# EAGLE board control_unit (EAGLE 5.11)
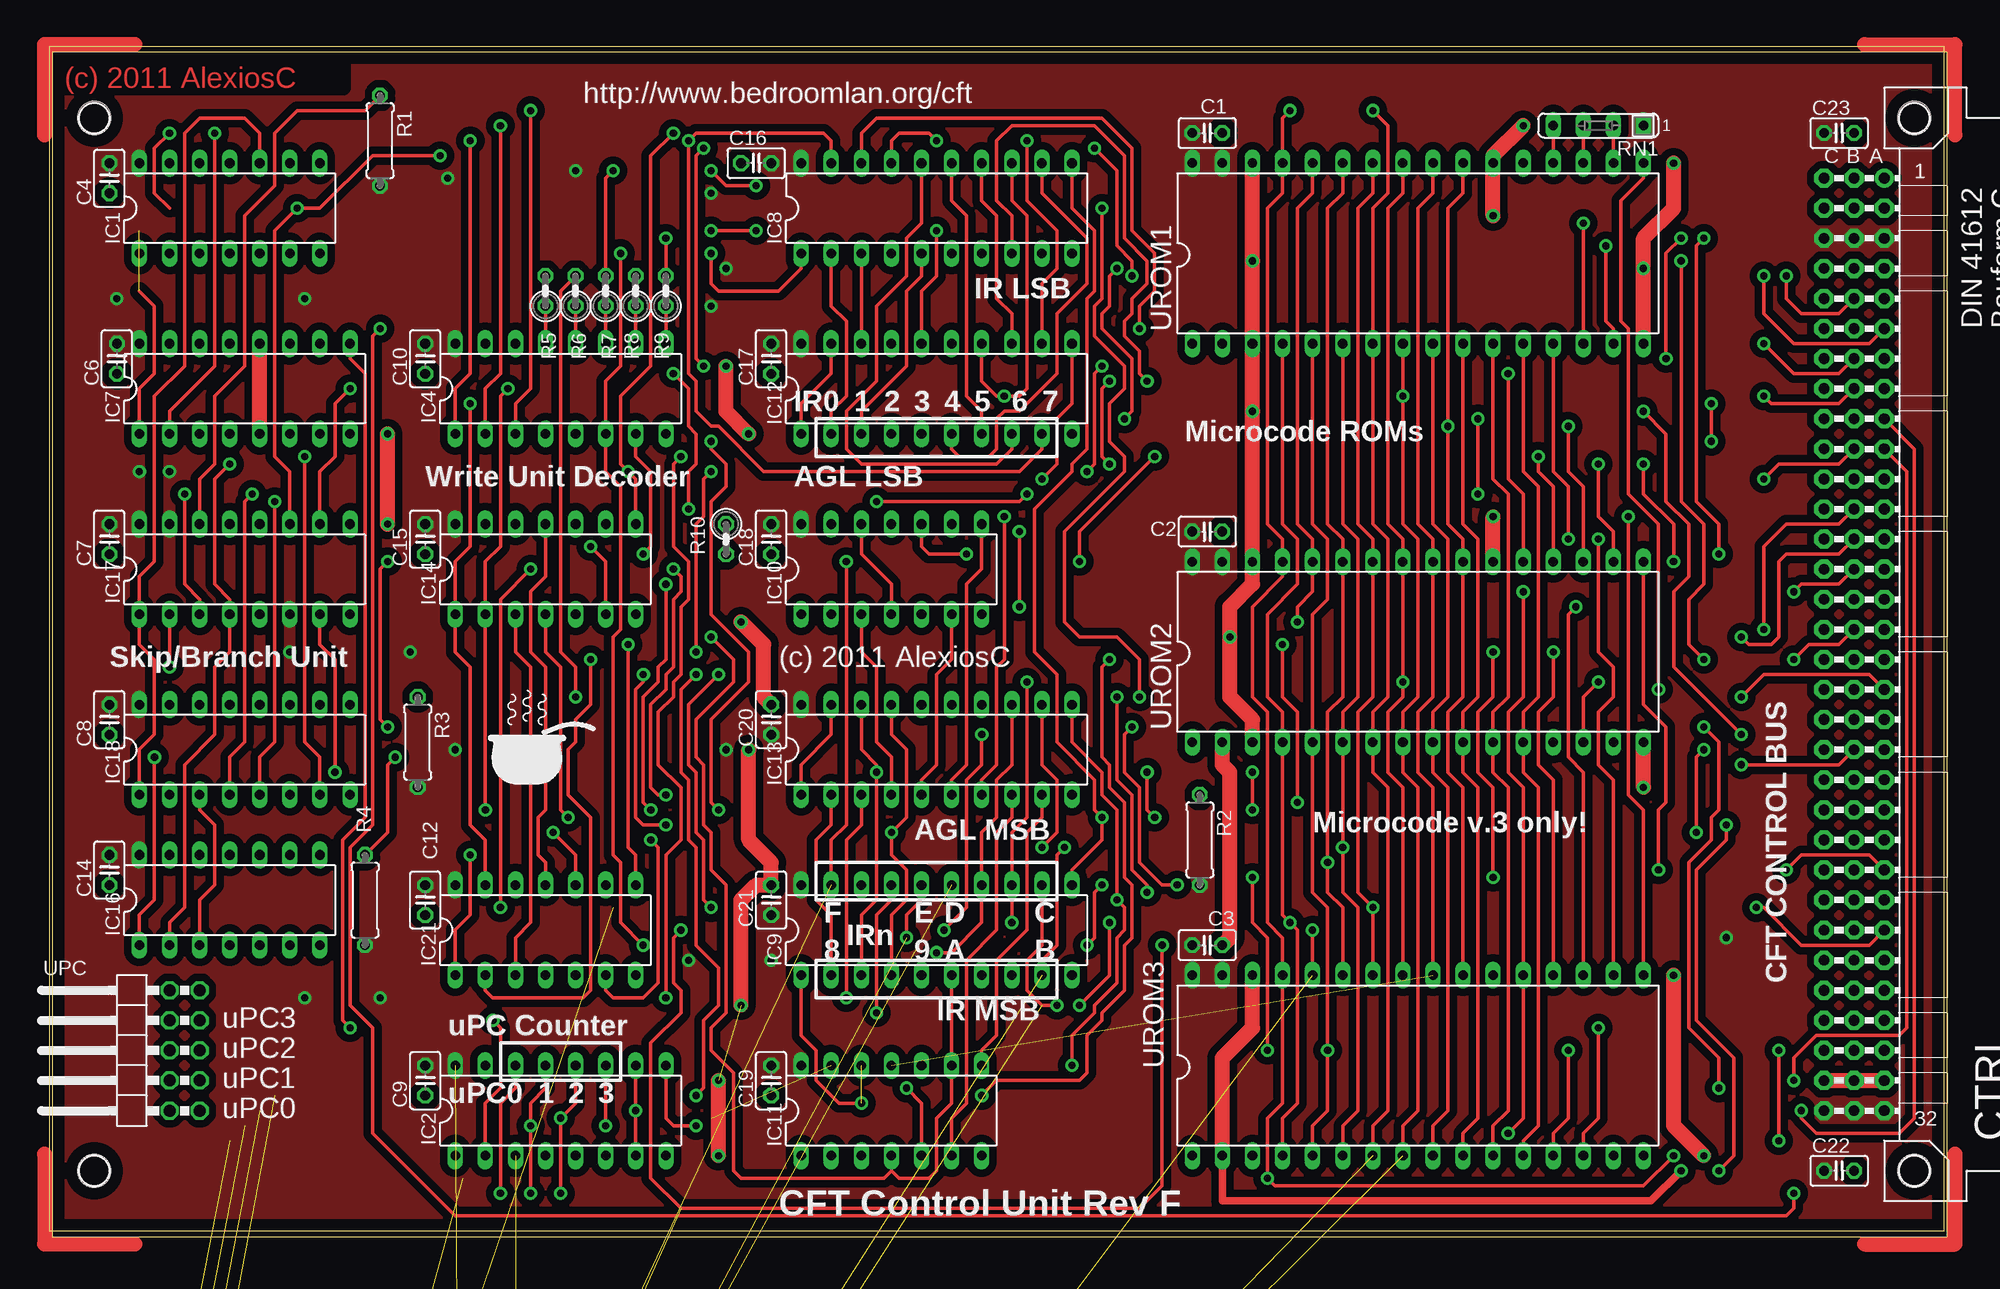
[diagram p4: board, top side]
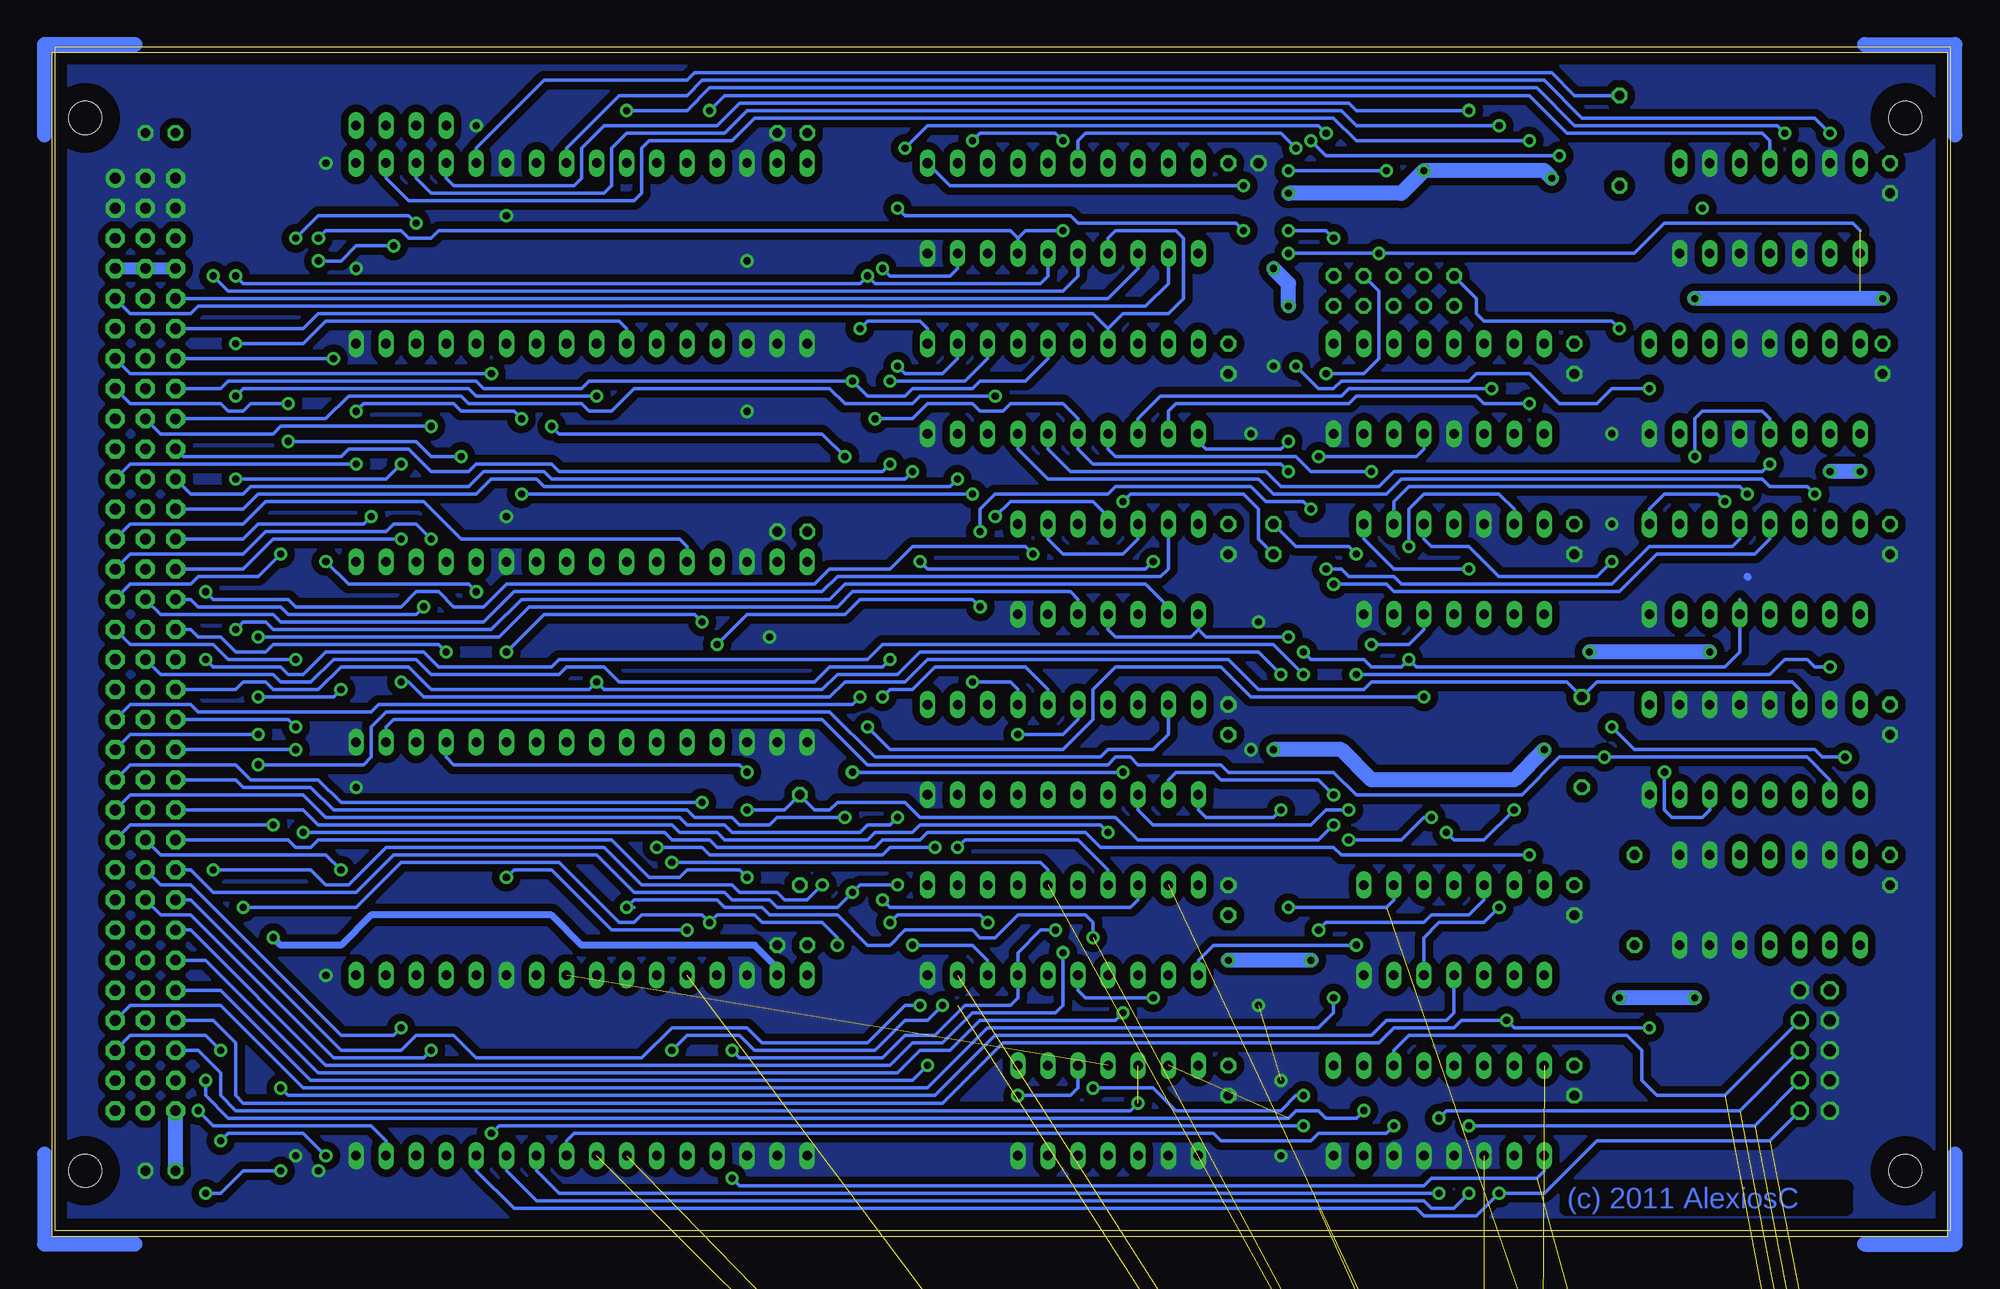
[diagram p5: board, bottom side, seen from below]

Size 160 x 100 mm. Coordinates in mm from the lower left corner, seen from the top.
Outline: 0,0 160,0 160,100 0,100 0,0
Copper layers (1*16): off 0.035mm / dielectric 1.5mm / Bottom 0.035mm
Design rules "cft-olimex-10mil": minimum track width 10mil, minimum drill 24mil, track to track 10mil, track to pad 10mil, pad to pad 10mil, via to via 10mil, smd to smd 10mil, copper to edge 40mil, drill to drill 10mil, minimum pad ring 10mil, minimum via ring 10mil, stop-mask expansion 0mil, vias tented up to drill 10mil, thermal gap 10mil
Net classes: 0 default: width 0.305 mm, clearance 0.254 mm; 1 Power: width 0.635 mm, clearance 0.254 mm; 2 12V: width 0.635 mm, clearance 0.635 mm

## Footprints (pad centres in the part's own frame; a part is rotated, then mirrored left to right if it is on the bottom)
C025-025X050 = drill 0.813 octagon: 1 -1.27,0; 2 1.27,0
VG96B = drill 0.914 pad 1.6 round: A1 154.94,39.37 | drill 0.914 pad 1.6 octagon: A2 154.94,36.83; A3 154.94,34.29; A4 154.94,31.75; A5 154.94,29.21; A6 154.94,26.67; A7 154.94,24.13; A8 154.94,21.59; A9 154.94,19.05; A10 154.94,16.51; A11 154.94,13.97; A12 154.94,11.43; A13 154.94,8.89; A14 154.94,6.35; A15 154.94,3.81; A16 154.94,1.27; A17 154.94,-1.27; A18 154.94,-3.81; A19 154.94,-6.35; A20 154.94,-8.89; A21 154.94,-11.43; A22 154.94,-13.97; A23 154.94,-16.51; A24 154.94,-19.05; A25 154.94,-21.59; A26 154.94,-24.13; A27 154.94,-26.67; A28 154.94,-29.21; A29 154.94,-31.75; A30 154.94,-34.29; A31 154.94,-36.83; A32 154.94,-39.37; B1 152.4,39.37; B2 152.4,36.83; B3 152.4,34.29; B4 152.4,31.75; B5 152.4,29.21; B6 152.4,26.67; B7 152.4,24.13; B8 152.4,21.59; B9 152.4,19.05; B10 152.4,16.51; B11 152.4,13.97; B12 152.4,11.43; B13 152.4,8.89; B14 152.4,6.35; B15 152.4,3.81; B16 152.4,1.27; B17 152.4,-1.27; B18 152.4,-3.81; B19 152.4,-6.35; B20 152.4,-8.89; B21 152.4,-11.43; B22 152.4,-13.97; B23 152.4,-16.51; B24 152.4,-19.05; B25 152.4,-21.59; B26 152.4,-24.13; B27 152.4,-26.67; B28 152.4,-29.21; B29 152.4,-31.75; B30 152.4,-34.29; B31 152.4,-36.83; B32 152.4,-39.37; C1 149.86,39.37; C2 149.86,36.83; C3 149.86,34.29; C4 149.86,31.75; C5 149.86,29.21; C6 149.86,26.67; C7 149.86,24.13; C8 149.86,21.59; C9 149.86,19.05; C10 149.86,16.51; C11 149.86,13.97; C12 149.86,11.43; C13 149.86,8.89; C14 149.86,6.35; C15 149.86,3.81; C16 149.86,1.27; C17 149.86,-1.27; C18 149.86,-3.81; C19 149.86,-6.35; C20 149.86,-8.89; C21 149.86,-11.43; C22 149.86,-13.97; C23 149.86,-16.51; C24 149.86,-19.05; C25 149.86,-21.59; C26 149.86,-24.13; C27 149.86,-26.67; C28 149.86,-29.21; C29 149.86,-31.75; C30 149.86,-34.29; C31 149.86,-36.83; C32 149.86,-39.37 | hole 2.794: 157.48,44.45; 157.48,-44.45; 3.81,44.45; 3.81,-44.45
DIL14 = drill 0.813 long: 1 -7.62,-3.81; 2 -5.08,-3.81; 3 -2.54,-3.81; 4 0,-3.81; 5 2.54,-3.81; 6 5.08,-3.81; 7 7.62,-3.81; 8 7.62,3.81; 9 5.08,3.81; 10 2.54,3.81; 11 0,3.81; 12 -2.54,3.81; 13 -5.08,3.81; 14 -7.62,3.81
DIL16 = drill 0.813 long: 1 -8.89,-3.81; 2 -6.35,-3.81; 3 -3.81,-3.81; 4 -1.27,-3.81; 5 1.27,-3.81; 6 3.81,-3.81; 7 6.35,-3.81; 8 8.89,-3.81; 9 8.89,3.81; 10 6.35,3.81; 11 3.81,3.81; 12 1.27,3.81; 13 -1.27,3.81; 14 -3.81,3.81; 15 -6.35,3.81; 16 -8.89,3.81
SO20W = smd 0.66 x 2.032: 1 -5.715,-5.029; 2 -4.445,-5.029; 3 -3.175,-5.029; 4 -1.905,-5.029; 5 -0.635,-5.029; 6 0.635,-5.029; 7 1.905,-5.029; 8 3.175,-5.029; 9 4.445,-5.029; 10 5.715,-5.029; 11 5.715,5.029; 12 4.445,5.029; 13 3.175,5.029; 14 1.905,5.029; 15 0.635,5.029; 16 -0.635,5.029; 17 -1.905,5.029; 18 -3.175,5.029; 19 -4.445,5.029; 20 -5.715,5.029
DIL20 = drill 0.813 long: 1 -11.43,-3.81; 2 -8.89,-3.81; 3 -6.35,-3.81; 4 -3.81,-3.81; 5 -1.27,-3.81; 6 1.27,-3.81; 7 3.81,-3.81; 8 6.35,-3.81; 9 8.89,-3.81; 10 11.43,-3.81; 11 11.43,3.81; 12 8.89,3.81; 13 6.35,3.81; 14 3.81,3.81; 15 1.27,3.81; 16 -1.27,3.81; 17 -3.81,3.81; 18 -6.35,3.81; 19 -8.89,3.81; 20 -11.43,3.81
0207/7 = drill 0.813 octagon: 1 -3.81,0; 2 3.81,0
0207/2V = drill 0.813 octagon: 1 -1.27,0; 2 1.27,0
SIL4 = drill 0.813 long: 1 -3.81,0; 2 -1.27,0; 3 1.27,0; 4 3.81,0
2X05/90 = drill 1.016 octagon: 1 -5.08,-6.35; 2 -5.08,-3.81; 3 -2.54,-6.35; 4 -2.54,-3.81; 5 0,-6.35; 6 0,-3.81; 7 2.54,-6.35; 8 2.54,-3.81; 9 5.08,-6.35; 10 5.08,-3.81
DIL32 = drill 0.813 long: 1 -19.05,-7.62; 2 -16.51,-7.62; 3 -13.97,-7.62; 4 -11.43,-7.62; 5 -8.89,-7.62; 6 -6.35,-7.62; 7 -3.81,-7.62; 8 -1.27,-7.62; 9 1.27,-7.62; 10 3.81,-7.62; 11 6.35,-7.62; 12 8.89,-7.62; 13 11.43,-7.62; 14 13.97,-7.62; 15 16.51,-7.62; 16 19.05,-7.62 | drill 0.8 long: 17 19.05,7.62; 18 16.51,7.62; 19 13.97,7.62; 20 11.43,7.62; 21 8.89,7.62; 22 6.35,7.62; 23 3.81,7.62; 24 1.27,7.62; 25 -1.27,7.62; 26 -3.81,7.62; 27 -6.35,7.62; 28 -8.89,7.62; 29 -11.43,7.62; 30 -13.97,7.62; 31 -16.51,7.62; 32 -19.05,7.62
22-23-2081 = drill 1 long: 1 -8.89,0; 2 -6.35,0; 3 -3.81,0; 4 -1.27,0; 5 1.27,0; 6 3.81,0; 7 6.35,0; 8 8.89,0

## Placement (x,y rotation side)
C1  0.1uF  [C025-025X050]  97.79,92.71 180 top
C2  0.1uF  [C025-025X050]  97.79,59.05 180 top
C3  0.1uF  [C025-025X050]  97.79,24.13 180 top
C4  0.1uF  [C025-025X050]  5.08,88.9 90 top
C5  0.1uF  [C025-025X050]  12.7,-93.98 0 top  (outside the outline)
C6  0.1uF  [C025-025X050]  5.71,73.66 90 top
C7  0.1uF  [C025-025X050]  5.08,58.42 90 top
C8  0.1uF  [C025-025X050]  5.08,43.18 90 top
C9  0.1uF  [C025-025X050]  31.75,12.7 90 top
C10  0.1uF  [C025-025X050]  31.75,73.66 90 top
C11  0.1uF  [C025-025X050]  19.68,-93.98 0 top  (outside the outline)
C12  0.1uF  [C025-025X050]  31.75,27.94 90 top
C13  0.1uF  [C025-025X050]  26.67,-93.98 0 top  (outside the outline)
C14  0.1uF  [C025-025X050]  5.08,30.48 90 top
C15  0.1uF  [C025-025X050]  31.75,58.42 90 top
C16  0.1uF  [C025-025X050]  59.69,90.17 0 top
C17  0.1uF  [C025-025X050]  60.96,73.66 90 top
C18  0.1uF  [C025-025X050]  60.96,58.42 90 top
C19  0.1uF  [C025-025X050]  60.96,12.7 90 top
C20  0.1uF  [C025-025X050]  60.96,43.18 90 top
C21  0.1uF  [C025-025X050]  60.96,27.94 90 top
C22  0.1uF  [C025-025X050]  151.13,5.08 0 top
C23  0.1uF  [C025-025X050]  151.13,92.71 0 top
C24  0.1uF  [C025-025X050]  33.66,-93.98 0 top  (outside the outline)
C25  0.1uF  [C025-025X050]  40.64,-93.98 0 top  (outside the outline)
C26  0.1uF  [C025-025X050]  47.62,-93.98 0 top  (outside the outline)
CTRL  [VG96B]  0,49.53 0 top
IC1  74HCT04N  [DIL14]  15.24,86.36 0 top
IC2  74ACT161N?  [DIL16]  43.18,10.16 0 top
IC3  74HC541DW  [SO20W]  -3.17,-104.78 0 top  (outside the outline)
IC4  74HCT138N  [DIL16]  43.18,71.12 0 top
IC5  74HC541DW  [SO20W]  -3.17,-117.47 0 top  (outside the outline)
IC7  74ACT175N  [DIL16]  16.51,71.12 0 top
IC8  74ACT273N  [DIL20]  74.93,86.36 0 top
IC9  74ACT273N  [DIL20]  74.93,25.4 0 top
IC10  74ACT08N  [DIL14]  71.12,55.88 0 top
IC11  74ACT08N  [DIL14]  71.12,10.16 0 top
IC12  74HCT541N  [DIL20]  74.93,71.12 0 top
IC13  74HCT541N  [DIL20]  74.93,40.64 0 top
IC14  74HCT4075E  [DIL14]  41.91,55.88 0 top
IC16  74HCT266N  [DIL14]  15.24,27.94 0 top
IC17  74ACT253N  [DIL16]  16.51,55.88 0 top
IC18  74ACT253N  [DIL16]  16.51,40.64 0 top
IC21  74ACT08N  [DIL14]  41.91,25.4 0 top
R1  2k2  [0207/7]  27.94,92.08 270 top
R2  2k2  [0207/7]  97.16,33.02 270 top
R3  2k2  [0207/7]  31.11,41.27 270 top
R4  2k2  [0207/7]  26.67,27.94 270 top
R5  47R  [0207/2V]  41.91,79.38 90 top
R6  47R  [0207/2V]  44.45,79.38 90 top
R7  47R  [0207/2V]  46.99,79.38 90 top
R8  47R  [0207/2V]  49.53,79.38 90 top
R9  47R  [0207/2V]  52.07,79.38 90 top
R10  47R  [0207/2V]  57.15,58.42 270 top
RN1  2k2  [SIL4]  130.81,93.34 180 top
U$3  SIGNATURESILK  [SIGNATURE]  37.47,37.47 0 top
UPC  [2X05/90]  6.35,15.24 90 top
UROM1  29F040  [DIL32]  115.57,82.55 0 top
UROM2  29F040  [DIL32]  115.57,48.9 0 top
UROM3  29F040  [DIL32]  115.57,13.97 0 top
X1  22-23-2081  [22-23-2081]  -1.27,-129.54 0 top  (outside the outline)
X2  22-23-2081  [22-23-2081]  -1.91,-140.97 0 top  (outside the outline)

## Tracks (layer width: path | path; a pad name or v marks a point on that pad's centre or on a via)
!CLI  (via drill 0.6)
  off 0.305: v123.19,72.39 123.19,63.5 124.46,62.23 UROM2.21
  Bottom 0.305: v123.19,72.39 153.67,72.39 CTRL.A7
!CLL  (via drill 0.6)
  off 0.305: v128.27,67.94 128.27,64.14 129.54,62.87 UROM2.19
  Bottom 0.305: CTRL.B9 151.13,67.31 141.6,67.31 140.97,67.94 v128.27,67.94
!CPL  (via drill 0.6)
  off 0.305: v130.81,64.77 130.81,60.33 132.08,59.05 UROM2.18 | CTRL.B10 151.13,64.77 146.05,64.77 v144.78,63.5
  Bottom 0.305: v144.78,63.5 132.08,63.5 v130.81,64.77
!END  (via drill 0.6)
  off 0.305: v124.46,53.98 124.46,45.09 123.19,43.81 123.19,38.73 124.46,37.47 UROM3.21 124.46,9.53 v123.19,8.26 | v137.16,56.52 137.16,59.69 134.62,62.23 v134.62,64.77 | IC2.9 52.07,9.53 52.7,8.89 v54.61,8.89
  Bottom 0.305: v124.46,53.98 125.09,54.61 135.25,54.61 v137.16,56.52 | v134.62,64.77 153.67,64.77 CTRL.A11 | v54.61,8.89 122.56,8.89 v123.19,8.26
!HALT  (via drill 0.6)  (1 unrouted)
  off 0.305: IC2.7 v49.53,10.16 IC2.10 | CTRL.A10 156.84,64.14 156.84,17.14 156.21,16.51 149.22,16.51 147.32,14.61 v147.32,12.7
  Bottom 0.305: v147.32,12.7 147.32,11.43 145.41,9.53 55.88,9.53 55.24,10.16 53.34,10.16 52.7,9.53 50.16,9.53 v49.53,10.16
!INCAC  (via drill 0.6)
  off 0.305: UROM2.17 134.62,44.45 136.53,42.55 136.53,36.2 135.89,35.56 v135.89,30.48
  Bottom 0.305: v135.89,30.48 137.16,31.75 151.13,31.75 CTRL.B23
!INCDR  (via drill 0.6)
  off 0.305: v130.81,17.14 130.81,9.53 129.54,8.26 UROM3.14
  Bottom 0.305: v130.81,17.14 131.44,16.51 135.89,16.51 148.59,29.21 151.13,29.21 CTRL.B24
!INCPC  (via drill 0.6)
  off 0.305: UROM3.13 127,8.26 128.27,9.53 v128.27,15.24
  Bottom 0.305: v128.27,15.24 128.91,14.61 136.53,14.61 148.59,26.67 151.13,26.67 CTRL.B25
!IO  (via drill 0.6)
  off 0.305: UROM3.18 132.08,38.1 130.81,39.37 130.81,43.81 132.08,45.09 132.08,47.62 130.81,48.9 v130.81,58.42
  Bottom 0.305: v130.81,58.42 141.6,58.42 144.15,55.88 CTRL.C14
!IRQS  (via drill 0.6)  (1 unrouted)
  off 0.305: UROM1.28 106.68,87.63 105.41,86.36 105.41,59.69 106.68,58.42 UROM2.28 106.68,53.98 105.41,52.7 v105.41,51.44 | v121.92,48.9 121.92,45.09 120.65,43.81 120.65,38.73 121.92,37.47 v121.92,29.84 | UROM3.28 v106.68,25.4
  Bottom 0.305: CTRL.A13 153.67,59.69 144.15,59.69 142.24,61.59 128.91,61.59 125.73,58.42 107.31,58.42 106.68,57.78 UROM2.28 | v105.41,51.44 106.05,52.07 118.75,52.07 v121.92,48.9 | v106.68,25.4 113.03,25.4 118.11,30.48 121.28,30.48 v121.92,29.84
!MEM  (via drill 0.6)
  off 0.305: UROM3.17 134.62,35.56 133.35,36.83 v133.35,60.33
  Bottom 0.305: v133.35,60.33 133.99,59.69 142.88,59.69 144.15,58.42 CTRL.C13
!R  (via drill 0.6)
  off 0.305: UROM3.19 129.54,38.73 128.27,40.01 128.27,52.07 v128.91,52.7
  Bottom 0.305: v128.91,52.7 129.54,52.07 140.34,52.07 140.97,52.7 147.96,52.7 148.59,53.34 CTRL.C15
!RAGL  (via drill 0.6)
  off 0.305: CTRL.B20 151.13,39.37 v142.88,39.37 | IC13.1 63.5,39.37 66.04,41.91 IC13.19 | v56.52,35.56 55.88,36.2 55.88,43.18 59.05,46.35 59.05,48.9 55.88,52.07 55.88,61.59 57.15,62.87 57.15,64.77 55.88,66.04 v55.88,66.67 | IC12.1 63.5,69.85 66.04,72.39 IC12.19
  Bottom 0.305: v142.88,39.37 133.99,39.37 133.35,40.01 133.35,42.55 132.08,43.81 94.61,43.81 90.81,40.01 71.75,40.01 71.12,40.64 67.31,40.64 66.04,41.91 IC13.19 | IC13.1 63.5,35.56 62.87,34.92 57.15,34.92 v56.52,35.56 | IC12.1 63.5,66.67 62.87,66.04 56.52,66.04 v55.88,66.67
!RESET  (via drill 0.6)  (2 unrouted)
  off 0.305: IC7.1 7.62,71.12 8.89,72.39 8.89,78.11 7.62,79.38 | v50.16,24.13 48.26,26.04 48.26,31.11 47.62,31.75 47.62,50.16 48.26,50.8 48.26,62.87 46.99,64.14 IC4.6 46.99,71.75 48.26,73.03 v48.26,82.55 | IC9.1 63.5,16.51 64.77,15.24 64.77,12.7 66.67,10.79 v68.58,10.79 | v55.88,82.55 55.88,80.01 56.52,79.38 61.59,79.38 63.5,81.28 IC8.1
  Bottom 0.305: CTRL.C30 147.96,15.24 146.05,13.34 146.05,11.43 144.78,10.16 69.22,10.16 v68.58,10.79 | 7.62,84.45 8.26,85.09 24.13,85.09 26.67,82.55 v48.26,82.55 v55.88,82.55 | v50.16,24.13 62.23,24.13 63.5,22.86 IC9.1
!RSTHOLD  (via drill 0.6)  (1 unrouted)
  off 0.305: v146.05,7.62 v146.05,15.24 | v137.16,6.35 134.62,3.81 103.5,3.81 v102.87,4.45 102.87,9.53 104.14,10.79 UROM3.29 104.14,24.77 102.87,26.04 102.87,43.81 101.6,45.09 101.6,52.7 104.14,55.24 UROM2.29 104.14,58.42 102.87,59.69 102.87,86.36 104.14,87.63 UROM1.29 104.14,93.98 v104.78,94.61
  Bottom 0.305: IC2.1 34.29,5.08 34.92,4.45 43.81,4.45 44.45,3.81 102.23,3.81 v102.87,4.45 | IC1.11 15.24,92.08 15.88,92.71 32.38,92.71 35.56,95.89 103.5,95.89 v104.78,94.61 | CTRL.A30 153.67,16.51 147.32,16.51 v146.05,15.24 | v137.16,6.35 139.06,8.26 145.41,8.26 v146.05,7.62
!SKIP  (via drill 0.6)  (1 unrouted)
  off 0.305: UROM3.7 111.76,8.89 113.03,10.16 113.03,37.47 111.76,38.73 UROM2.7 111.76,43.81 113.03,45.09 113.03,58.42 111.76,59.69 UROM1.7 111.76,86.36 113.03,87.63 113.03,93.34 v111.76,94.61 | v13.97,92.71 13.97,73.03 10.16,69.22 IC7.2 | CTRL.B7 151.13,72.39 147.32,72.39 v144.78,74.93
  Bottom 0.305: v111.76,94.61 106.68,94.61 104.78,96.52 34.92,96.52 31.75,93.34 14.61,93.34 v13.97,92.71 | v144.78,74.93 139.06,74.93 137.16,76.83 112.39,76.83 111.76,76.2 UROM1.7
!STI  (via drill 0.6)
  off 0.305: UROM2.20 127,62.87 125.73,64.14 v125.73,65.41 | v140.34,66.67 v140.34,69.85
  Bottom 0.305: CTRL.A8 153.67,69.85 146.05,69.85 145.41,69.22 144.15,69.22 143.51,69.85 v140.34,69.85 | v125.73,65.41 128.27,65.41 129.54,66.67 v140.34,66.67
!W  (via drill 0.6)
  off 0.305: UROM3.20 127,38.1 125.73,39.37 125.73,43.81 127,45.09 v127,48.9
  Bottom 0.305: v127,48.9 127.64,49.53 141.6,49.53 142.24,48.9 144.78,48.9 146.05,50.16 147.96,50.16 148.59,50.8 CTRL.C16
!WAC  (via drill 0.6)
  off 0.305: v92.08,45.09 92.08,48.26 90.17,50.16 87,50.16 85.72,51.44 85.72,59.05 90.81,64.14 90.81,65.41 89.53,66.67 89.53,69.85 90.81,71.12 90.81,73.03 88.27,75.56 88.27,78.11 88.9,78.74 v88.9,86.36 | R9.2 v52.07,83.82 | v55.88,84.45 v59.69,84.45
  Bottom 0.305: CTRL.A19 153.67,44.45 148.59,44.45 147.96,43.81 133.35,43.81 132.72,44.45 92.71,44.45 v92.08,45.09 | v52.07,83.82 52.7,84.45 v55.88,84.45 | v88.9,86.36 88.27,85.72 74.3,85.72 73.66,85.09 60.33,85.09 v59.69,84.45
!WALU  (via drill 0.6)
  off 0.305: v69.85,61.59 81.92,61.59 v82.55,62.23 | v120.65,62.23 v120.65,68.58 | v134.62,69.22 136.53,67.31 136.53,61.59 138.43,59.69 138.43,55.24 137.16,53.98 137.16,47.62 v142.88,41.91
  Bottom 0.305: CTRL.A20 153.67,41.91 v142.88,41.91 | v69.85,61.59 69.22,62.23 59.69,62.23 58.42,60.96 58.42,58.42 R10.2 | v82.55,62.23 v120.65,62.23 | v120.65,68.58 121.28,69.22 125.73,69.22 126.36,69.85 133.99,69.85 v134.62,69.22
!WAR  (via drill 0.6)
  off 0.305: v27.94,76.2 27.3,75.56 27.3,34.29 25.4,32.38 25.4,19.05 27.3,17.14 27.3,8.26 34.29,1.27 146.69,1.27 147.32,1.91 v147.32,3.17 | v140.97,5.08 142.24,6.35 142.24,14.61 139.06,17.78 139.06,30.48 141.6,33.02 v141.6,34.29
  Bottom 0.305: CTRL.A23 153.67,34.29 v141.6,34.29 | v27.94,76.2 28.57,76.83 39.37,76.83 40.01,77.47 40.01,78.74 R5.2 | v147.32,3.17 146.05,3.17 144.15,5.08 v140.97,5.08
!WDR  (via drill 0.6)
  off 0.305: v104.14,49.53 104.14,45.09 105.41,43.81 v105.41,36.2 | v81.92,59.05 v81.92,52.7 | v53.98,60.96 53.98,64.14 54.61,64.77 54.61,67.31 53.98,67.94 53.98,71.12 v52.7,72.39
  Bottom 0.305: CTRL.A21 153.67,39.37 144.78,39.37 143.51,38.1 137.79,38.1 135.89,36.2 v105.41,36.2 | v104.14,49.53 101.6,52.07 93.34,52.07 92.08,53.34 82.55,53.34 v81.92,52.7 | v81.92,59.05 81.92,60.96 80.64,62.23 71.12,62.23 70.48,62.87 59.05,62.87 57.78,61.59 54.61,61.59 v53.98,60.96 | v52.7,72.39 49.53,72.39 48.26,73.66 48.26,79.38 R8.2
!WIR  (via drill 0.6)
  off 0.305: IC9.11 86.36,30.48 88.9,33.02 v88.9,34.92 88.27,35.56 88.27,38.1 85.09,41.27 85.09,46.99 83.19,48.9 83.19,60.96 86.36,64.14 86.36,64.77 87.63,66.04 87.63,78.74 88.27,79.38 88.27,84.45 86.36,86.36 IC8.11 | v47.62,89.53 46.99,88.9 R7.2 | v55.88,89.53 57.15,88.27 v59.69,88.27
  Bottom 0.305: v88.9,34.92 89.53,34.29 91.44,34.29 92.08,33.66 102.87,33.66 103.5,34.29 106.68,34.29 107.31,34.92 137.16,34.92 139.06,36.83 153.67,36.83 CTRL.A22 | v55.88,89.53 v47.62,89.53 | v59.69,88.27 84.45,88.27 IC8.11
!WPC  (via drill 0.6)
  off 0.305: CTRL.A24 153.67,31.75 147.96,31.75 v146.69,30.48 | v44.45,45.09 44.45,47.62 43.18,48.9 43.18,79.38 R6.2 | v91.44,42.55 90.81,41.91 90.81,38.73 92.08,37.47 92.08,31.11 93.98,29.21 v95.25,29.21
  Bottom 0.305: v44.45,45.09 59.05,45.09 61.59,47.62 70.48,47.62 72.39,45.72 72.39,43.18 74.93,40.64 89.53,40.64 v91.44,42.55 | v95.25,29.21 96.52,27.94 98.42,27.94 99.06,28.57 102.23,28.57 102.87,29.21 110.49,29.21 113.67,32.38 132.08,32.38 135.25,29.21 137.16,29.21 138.43,30.48 v146.69,30.48
+12V
  off 1.27: CTRL.C31 CTRL.B31 CTRL.A31
AINDEX  (via drill 0.6)  (1 unrouted)
  off 0.305: UROM3.8 114.3,8.89 115.57,10.16 115.57,37.47 114.3,38.73 UROM2.8 114.3,43.81 115.57,45.09 115.57,58.42 114.3,59.69 v114.3,70.48 UROM1.8 | CTRL.B8 151.13,69.85 145.41,69.85 v144.78,70.48
  Bottom 0.305: v144.78,70.48 144.15,71.12 125.09,71.12 124.46,70.48 v114.3,70.48
CLK1  (via drill 0.6)
  off 0.305: v37.47,17.78 38.1,17.14 38.1,12.06 36.83,10.79 IC2.2 | IC7.9 25.4,73.66 26.67,72.39 26.67,34.92 24.77,33.02 24.77,17.78 v25.4,17.14
  Bottom 0.305: v25.4,17.14 36.83,17.14 v37.47,17.78 41.27,17.78 41.91,17.14 46.99,17.14 48.26,15.88 80.01,15.88 85.09,10.79 144.15,10.79 144.78,11.43 144.78,15.88 146.69,17.78 CTRL.C29
CLK5  (via drill 0.6)
  off 0.305: v53.34,65.41 52.7,64.77 52.7,57.78 53.98,56.52 53.98,53.34 53.34,52.7 53.34,46.99 52.7,46.35 52.7,45.09 51.44,43.81 51.44,39.37 53.34,37.47 53.34,33.02 52.07,31.75 v52.07,19.68
  Bottom 0.305: CTRL.A29 153.67,19.05 146.05,19.05 139.06,12.06 86.36,12.06 81.28,17.14 53.34,17.14 52.07,18.41 v52.07,19.68 | v53.34,65.41 45.09,65.41 44.45,66.04 IC4.5
FL  (via drill 0.6)  (1 unrouted)
  off 0.305: v56.52,46.99 53.98,44.45 53.98,39.37 54.61,38.73 54.61,33.66 55.24,33.02 55.24,27.94 v55.88,27.3 | UROM1.25 114.3,87.63 113.03,86.36 113.03,59.69 114.3,58.42 UROM2.25 v114.3,46.35 114.3,45.09 113.03,43.81 113.03,38.73 114.3,37.47 UROM3.25
  Bottom 0.305: v56.52,46.99 58.42,48.9 87,48.9 88.9,46.99 93.98,46.99 95.25,45.72 113.67,45.72 v114.3,46.35 114.94,45.72 128.27,45.72 130.18,47.62 135.89,47.62 137.79,45.72 141.6,45.72 142.24,46.35 144.15,46.35 144.78,45.72 CTRL.C18 | v55.88,27.3 47.62,27.3 46.99,27.94 IC21.9
FNEG  (via drill 0.6)
  off 0.305: IC21.1 34.29,25.4 35.56,26.67 v35.56,31.75 | v139.06,33.66 139.06,40.01 v139.7,40.64
  Bottom 0.305: v35.56,31.75 51.44,31.75 52.07,32.38 71.75,32.38 73.03,33.66 86.36,33.66 87,33.02 90.17,33.02 90.81,32.38 104.14,32.38 104.78,33.02 107.95,33.02 108.58,33.66 v139.06,33.66 | v139.7,40.64 CTRL.C20
FV  (via drill 0.6)  (1 unrouted)
  off 0.305: UROM1.4 104.14,59.69 105.41,58.42 105.41,54.61 102.87,52.07 102.87,45.09 104.14,43.81 UROM2.4 104.14,26.67 v104.78,26.04 105.41,25.4 105.41,10.79 104.14,9.53 UROM3.4 | CTRL.A26 153.67,24.13 147.96,24.13 144.78,27.3 v144.15,27.3 | v53.34,25.4 52.7,24.77 52.7,20.95 53.34,20.32 53.34,18.41 50.8,15.88 50.8,4.45 53.34,1.91 92.08,1.91 93.98,3.81 v93.98,24.13
  Bottom 0.305: v144.15,27.3 134.62,27.3 130.81,31.11 117.47,31.11 112.39,26.04 111.12,26.04 110.49,26.67 105.41,26.67 v104.78,26.04 104.14,26.67 100.97,26.67 100.33,26.04 95.25,26.04 93.98,24.77 v93.98,24.13 | IC21.12 39.37,27.94 40.64,26.67 43.81,26.67 44.45,26.04 52.7,26.04 v53.34,25.4
FZERO  (via drill 0.6)
  off 0.305: v140.97,12.06 140.97,14.61 138.43,17.14 138.43,31.11 140.34,33.02 140.34,34.92 140.97,35.56 140.97,41.27 v139.7,42.55
  Bottom 0.305: IC21.4 41.91,18.41 42.55,17.78 47.62,17.78 48.9,16.51 80.64,16.51 85.72,11.43 140.34,11.43 v140.97,12.06 | v139.7,42.55 140.34,43.18 CTRL.C19
GND  (via drill 0.6, 0.61)  (13 unrouted)
  off 0.635: v137.79,5.08 135.25,2.54 99.06,2.54 99.06,5.71
  off 1.27: UROM3.2 99.06,14.61 101.6,17.14 UROM3.30 | IC7.5 IC7.12 | v56.52,6.35 v56.52,12.7 | v58.42,19.05 58.42,27.94 59.69,29.21 C21.2 60.96,31.11 59.05,33.02 v59.05,40.64 | UROM1.16 134.62,83.82 137.16,86.36 v137.16,90.17 | v124.46,93.34 121.92,90.81 UROM1.22 v121.92,85.72 | v137.16,21.59 137.16,8.89 v139.7,6.35 | UROM1.30 v101.6,81.92 UROM1.3 v101.6,69.22 UROM2.30 101.6,54.61 99.69,52.7 v99.69,50.16 99.69,45.09 101.6,43.18 UROM2.3 | UROM2.22 v121.92,60.33 | C3.1 99.69,24.77 99.69,38.73 99.06,39.37 UROM2.2 | v134.62,37.47 UROM2.16 | v57.15,73.03 57.15,69.22 v59.05,67.31 | C20.2 60.33,45.09 60.33,49.53 v58.42,51.44 | v28.57,59.69 v28.57,67.31
  Bottom 0.635: 17.12,55.22 17.14,55.24
  other vias: 134.62,81.28
  pour Bottom (isolate 0.635, no thermals): 0,0 160.02,0 160.02,99.06 0,99.06
IBUS0
  off 0.305: IC12.18 IC8.3
  Bottom 0.305: IC8.3 68.58,81.28 71.12,78.74 CTRL.C5
IBUS1
  Bottom 0.305: CTRL.C6 139.06,76.2 137.79,77.47 72.39,77.47 71.12,76.2 | IC8.4 71.12,83.82 70.48,84.45 65.41,84.45 64.77,83.82 64.77,78.74 66.04,77.47 69.85,77.47 71.12,76.2 | 71.12,76.2 IC12.17
IBUS2  (via drill 0.6)
  off 0.305: v137.79,83.82 136.53,82.55 v136.53,73.66 | IC12.16 73.66,79.38 74.93,80.64 v74.93,84.45
  Bottom 0.305: v137.79,83.82 137.16,84.45 130.81,84.45 130.18,83.82 128.27,83.82 127.64,84.45 79.38,84.45 78.74,83.82 | 78.74,83.82 IC8.7 | v136.53,73.66 CTRL.C7 | v74.93,84.45 78.11,84.45 78.74,83.82
IBUS3  (via drill 0.6)
  off 0.305: IC8.8 81.28,85.72 80.01,87 80.01,92.08 81.28,93.34 88.27,93.34 90.81,90.81 90.81,83.82 92.71,81.92 92.71,80.01 91.44,78.74 91.44,77.47 90.81,76.83 90.81,75.56 92.08,74.3 92.08,72.39 v92.71,71.75
  Bottom 0.305: CTRL.C8 146.05,71.12 145.41,71.75 124.46,71.75 123.83,71.12 115.57,71.12 114.94,71.75 v92.71,71.75 91.44,70.48 88.27,70.48 87.63,71.12 82.55,71.12 81.92,71.75 78.11,71.75 76.2,73.66 IC12.15
IBUS4  (via drill 0.6)
  off 0.305: IC8.13 81.28,87 82.55,85.72 82.55,71.12 81.92,70.48 v80.64,70.48 80.01,70.48 78.74,71.75 IC12.14
  Bottom 0.305: CTRL.C9 137.16,68.58 135.25,70.48 125.73,70.48 125.09,69.85 115.57,69.85 114.94,69.22 113.03,69.22 111.12,71.12 94.61,71.12 93.34,69.85 87.63,69.85 87,70.48 v80.64,70.48
IBUS5  (via drill 0.6)
  off 0.305: v89.53,64.77 88.9,65.41 88.9,71.12 v89.53,71.75 | IC8.14 78.74,87 80.01,85.72 80.01,78.74 81.28,77.47 IC12.13
  Bottom 0.305: CTRL.C10 149.22,65.41 135.89,65.41 135.25,66.04 130.18,66.04 128.27,64.14 125.09,64.14 124.46,64.77 118.11,64.77 117.47,64.14 90.17,64.14 v89.53,64.77 | v89.53,71.75 83.19,71.75 81.28,73.66 IC12.13
IBUS6  (via drill 0.6)
  off 0.305: v87.63,64.14 88.27,64.77 88.27,72.39 v88.9,73.03 | IC12.12 83.82,80.01 85.09,81.28 85.09,84.45 82.55,87 v82.55,92.08 | IC8.17 71.12,92.08 71.75,92.71 74.3,92.71 v74.93,92.08
  Bottom 0.305: v88.9,73.03 88.27,72.39 85.09,72.39 83.82,73.66 IC12.12 | v87.63,64.14 88.27,63.5 118.11,63.5 118.75,64.14 123.83,64.14 125.09,62.87 143.51,62.87 144.15,62.23 148.59,62.23 CTRL.C11 | v82.55,92.08 81.92,92.71 75.56,92.71 v74.93,92.08
IBUS7  (via drill 0.6)
  off 0.305: v83.82,63.5 85.09,64.77 85.09,68.58 86.36,69.85 IC12.11 | IC8.18 68.58,92.71 69.85,93.98 88.9,93.98 91.44,91.44 91.44,84.45 93.34,82.55 93.34,79.38 92.08,78.11 v92.08,76.2
  Bottom 0.305: v83.82,63.5 84.45,62.87 118.75,62.87 119.38,63.5 123.19,63.5 124.46,62.23 142.88,62.23 144.15,60.96 CTRL.C12 | IC12.11 86.36,76.2 87,76.83 91.44,76.83 v92.08,76.2
IBUS8  (via drill 0.6)
  off 0.305: IC13.18 68.58,40.64 69.85,39.37 v69.85,38.73 69.85,27.94 68.58,26.67 IC9.3 | v92.71,38.73 92.71,35.56 v93.34,34.92
  Bottom 0.305: CTRL.C21 144.78,38.1 144.15,37.47 138.43,37.47 136.53,35.56 106.68,35.56 106.05,34.92 102.87,34.92 102.23,34.29 99.69,34.29 99.06,34.92 v93.34,34.92 | v69.85,38.73 v92.71,38.73
IBUS9  (via drill 0.6)
  off 0.305: IC13.17 71.12,41.91 72.39,40.64 72.39,34.92 v71.12,33.66 71.12,31.75 72.39,30.48 72.39,27.94 71.12,26.67 IC9.4
  Bottom 0.305: CTRL.C22 139.06,35.56 137.79,34.29 107.95,34.29 107.31,33.66 104.14,33.66 103.5,33.02 91.44,33.02 90.81,33.66 87.63,33.66 87,34.29 71.75,34.29 v71.12,33.66
IBUS10  (via drill 0.6)
  off 0.305: v78.74,41.91 78.74,39.37 77.47,38.1 77.47,27.3 v75.56,25.4 | v102.87,15.24 102.87,24.77 101.6,26.04 v101.6,29.84
  Bottom 0.305: CTRL.C23 140.34,33.02 139.7,32.38 138.43,32.38 137.79,33.02 113.03,33.02 109.86,29.84 107.31,29.84 106.68,30.48 102.23,30.48 v101.6,29.84 | IC13.16 73.66,43.18 74.93,41.91 v78.74,41.91 | v75.56,25.4 76.83,25.4 78.74,23.5 IC9.7 78.74,19.68 79.38,19.05 83.19,19.05 85.72,16.51 88.27,16.51 90.17,14.61 102.23,14.61 v102.87,15.24
IBUS11  (via drill 0.6)
  off 0.305: v88.9,29.21 88.27,28.57 88.27,24.77 v87.63,24.13 | v90.17,45.09 90.17,38.1 91.44,36.83 91.44,30.48 92.71,29.21 v92.71,28.57
  Bottom 0.305: CTRL.C24 148.59,30.48 146.69,28.57 134.62,28.57 131.44,31.75 114.3,31.75 111.12,28.57 103.5,28.57 102.87,27.94 99.69,27.94 99.06,27.3 93.98,27.3 v92.71,28.57 92.08,29.21 v88.9,29.21 | IC9.8 81.28,22.86 82.55,24.13 v87.63,24.13 | IC13.15 76.2,45.72 78.11,47.62 85.72,47.62 87.63,45.72 89.53,45.72 v90.17,45.09
IBUS12  (via drill 0.6)
  off 0.305: v81.28,26.04 IC9.13 81.28,33.66 82.55,34.92 v82.55,46.35 | v89.53,26.04 89.53,21.59 v87,19.05
  Bottom 0.305: v89.53,26.04 88.9,26.67 81.92,26.67 v81.28,26.04 | v87,19.05 88.27,19.05 91.44,15.88 100.33,15.88 101.6,17.14 107.95,17.14 110.49,14.61 124.46,14.61 126.36,16.51 129.54,16.51 130.81,15.24 135.89,15.24 148.59,27.94 CTRL.C25 | IC13.14 78.74,45.72 79.38,46.35 v82.55,46.35
IBUS13  (via drill 0.6)
  off 0.305: IC13.13 81.28,39.37 80.01,38.1 80.01,34.92 78.74,33.66 IC9.14 78.74,26.04 76.2,23.5 v74.93,23.5
  Bottom 0.305: v74.93,23.5 74.93,19.05 75.56,18.41 82.55,18.41 85.09,15.88 87.63,15.88 89.53,13.97 137.16,13.97 148.59,25.4 CTRL.C26
IBUS14  (via drill 0.6)
  off 0.305: v69.85,18.41 69.85,26.67 71.12,27.94 IC9.17 | v83.82,32.38 85.09,33.66 85.09,38.1 83.82,39.37 IC13.12
  Bottom 0.305: v69.85,18.41 70.48,17.78 81.92,17.78 84.45,15.24 87,15.24 88.9,13.34 137.79,13.34 147.32,22.86 CTRL.C27 | IC9.17 71.12,30.48 73.66,33.02 83.19,33.02 v83.82,32.38
IBUS15  (via drill 0.6)
  off 0.305: v86.36,13.97 86.36,16.51 88.27,18.41 88.27,19.05 90.17,20.95 90.17,24.77 90.81,25.4 90.81,27.3 v90.17,27.94 90.17,35.56 88.9,36.83 88.9,38.73 86.36,41.27 IC13.11
  Bottom 0.305: CTRL.C28 146.05,20.32 138.43,12.7 87.63,12.7 v86.36,13.97 | v90.17,27.94 89.53,27.3 69.22,27.3 68.58,27.94 IC9.18
IR0  (via drill 0.6)
  off 0.305: v35.56,69.85 35.56,57.78 34.29,56.52 IC14.1 34.29,48.9 35.56,47.62 35.56,34.29 36.83,33.02 IC21.13 | IC12.2 66.04,69.22 67.31,70.48 67.31,76.83 66.04,78.11 IC8.2
  Bottom 0.305: v35.56,69.85 39.37,69.85 40.01,70.48 50.16,70.48 50.8,69.85 65.41,69.85 66.04,69.22 IC12.2 | CTRL.A5 153.67,77.47 148.59,77.47 147.96,78.11 67.94,78.11 66.04,80.01 IC8.2 66.04,81.28
IR1  (via drill 0.6)
  off 0.305: v36.83,35.56 IC14.2 36.83,56.52 38.1,57.78 38.1,70.48 v38.73,71.12 | CTRL.B5 151.13,77.47 147.96,77.47 146.69,78.74 v146.69,80.64 | IC12.3 68.58,69.22 72.39,73.03 72.39,79.38 73.66,80.64 IC8.5 | v42.55,33.66 44.45,31.75 IC21.10
  Bottom 0.305: v36.83,35.56 39.37,33.02 41.91,33.02 v42.55,33.66 | v38.73,71.12 50.8,71.12 51.44,70.48 66.67,70.48 68.58,68.58 IC12.3 | v146.69,80.64 145.41,79.38 74.93,79.38 73.66,80.64 IC8.5
IR2  (via drill 0.6)
  off 0.305: v38.1,27.3 38.1,53.34 v40.64,55.88 | IC14.8 49.53,63.5 v48.9,64.14 48.26,64.77 48.26,70.48 50.8,73.03 50.8,90.81 v52.7,92.71 | CTRL.A6 153.67,74.93 147.32,74.93 144.78,77.47 v144.78,80.64 | v88.27,91.44 90.17,89.53 90.17,83.19 91.44,81.92 v91.44,80.64
  Bottom 0.305: v40.64,55.88 46.99,55.88 49.53,58.42 IC14.8 | v48.9,64.14 53.98,64.14 55.24,65.41 70.48,65.41 71.12,66.04 IC12.4 | IC8.6 76.2,80.64 76.83,80.01 90.81,80.01 v91.44,80.64 92.08,80.01 144.15,80.01 v144.78,80.64 | v88.27,91.44 86.36,93.34 53.34,93.34 v52.7,92.71 | v38.1,27.3 39.37,26.04 43.18,26.04 44.45,24.77 IC21.5
IR3  (via drill 0.6, 0.61)
  off 0.305: v54.61,48.9 54.61,59.69 55.24,60.33 55.24,63.5 v55.88,64.14 | v90.17,81.28 89.53,80.64 89.53,78.11 88.9,77.47 88.9,76.2 91.44,73.66 91.44,69.22 v90.81,68.58 | IC21.2 36.83,20.32 37.47,19.68 45.09,19.68 45.72,20.32 45.72,34.92 43.81,36.83 43.81,40.64 44.45,41.27 44.45,43.18 45.72,44.45 v45.72,48.26
  Bottom 0.305: 17.78,53.34 IC17.5 17.78,48.9 19.05,47.62 45.09,47.62 v45.72,48.26 46.35,47.62 48.9,47.62 49.53,48.26 53.98,48.26 v54.61,48.9 | v55.88,64.14 56.52,64.77 72.39,64.77 73.66,66.04 IC12.5 73.66,68.58 74.93,69.85 79.38,69.85 80.01,69.22 81.92,69.22 82.55,69.85 86.36,69.85 87.63,68.58 v90.81,68.58 | IC8.9 83.82,81.28 84.45,80.64 89.53,80.64 v90.17,81.28
IR4  (via drill 0.6)
  off 0.305: v15.24,64.77 13.97,63.5 13.97,54.61 15.24,53.34 IC17.4 15.24,48.9 13.97,47.62 13.97,41.91 11.43,39.37 11.43,27.3 10.16,26.04 IC16.2 | IC12.6 76.2,66.04 76.83,65.41 79.38,65.41 80.01,66.04 80.01,68.58 80.64,69.22 81.92,69.22 85.09,72.39 85.09,77.47 87.63,80.01 87.63,83.82 83.82,87.63 IC8.12
  Bottom 0.305: v15.24,64.77 15.88,64.14 46.99,64.14 48.26,62.87 56.52,62.87 57.78,64.14 74.3,64.14 76.2,66.04 IC12.6
IR5  (via drill 0.6)
  off 0.305: IC17.3 12.7,53.34 11.43,54.61 v11.43,62.23 | IC8.15 76.2,87 77.47,85.72 77.47,70.48 78.74,69.22 IC12.7
  Bottom 0.305: v11.43,62.23 12.06,62.87 15.24,62.87 15.88,63.5 46.35,63.5 47.62,62.23 57.15,62.23 58.42,63.5 76.2,63.5 78.74,66.04 IC12.7
IR6  (via drill 0.6)
  off 0.305: IC17.10 22.86,64.14 24.13,65.41 24.13,69.85 v25.4,71.12 | v55.24,73.03 54.61,73.66 54.61,90.81 v55.24,91.44 | IC8.16 73.66,85.09 72.39,83.82 72.39,80.64 69.85,78.11 69.85,71.75 67.31,69.22 67.31,66.04 68.58,64.77 80.01,64.77 81.28,66.04 IC12.8
  Bottom 0.305: v25.4,71.12 28.57,71.12 29.84,69.85 33.02,69.85 35.56,72.39 40.01,72.39 40.64,71.75 51.44,71.75 52.07,71.12 53.34,71.12 v55.24,73.03 | v55.24,91.44 56.52,92.71 73.03,92.71 73.66,92.08 IC8.16
IR7  (via drill 0.6)
  off 0.305: IC17.11 20.32,64.14 19.05,65.41 19.05,84.45 v20.95,86.36 22.86,86.36 27.3,90.81 v33.02,90.81 | IC12.9 83.82,66.04 81.92,64.14 60.33,64.14 56.52,67.94 55.88,67.94 54.61,69.22 54.61,71.75 53.98,72.39 v53.98,92.08 54.61,92.71 65.41,92.71 66.04,92.08 IC8.19
  Bottom 0.305: v53.98,92.08 52.7,90.81 v33.02,90.81
IR8  (via drill 0.6)
  off 0.305: IC13.2 66.04,34.29 64.77,33.02 64.77,27.94 66.04,26.67 IC9.2 | v52.7,55.88 53.34,55.24 53.34,53.98 52.7,53.34 52.7,47.62 52.07,46.99 52.07,45.72 50.8,44.45 50.8,37.47 51.44,36.83 v52.07,36.83
  Bottom 0.305: IC17.12 17.78,58.42 18.41,57.78 25.4,57.78 28.57,54.61 46.35,54.61 46.99,55.24 50.8,55.24 51.44,55.88 v52.7,55.88 | v52.07,36.83 53.34,38.1 61.59,38.1 62.23,38.73 65.41,38.73 66.04,38.1 IC13.2
IR9  (via drill 0.6)
  off 0.305: IC13.3 68.58,34.29 67.31,33.02 v67.31,19.68 | v52.07,54.61 52.07,48.26 51.44,47.62 51.44,46.35 50.16,45.09 50.16,36.2 v50.8,35.56
  Bottom 0.305: v52.07,54.61 47.62,54.61 46.99,53.98 27.94,53.98 24.77,57.15 16.51,57.15 15.24,58.42 IC17.13 | IC13.3 68.58,35.56 67.31,34.29 53.98,34.29 52.7,35.56 v50.8,35.56 | v67.31,19.68 73.03,19.68 73.66,20.32 IC9.5
IR10  (via drill 0.6)
  off 0.305: IC9.6 IC11.9 76.2,10.79 74.93,9.53 74.93,5.08 74.3,4.45 71.75,4.45 71.12,5.08 | IC10.12 68.58,57.15 71.12,54.61 IC10.4 | 71.12,5.08 IC11.4 | v55.88,50.16 57.78,48.26 57.78,46.35 54.61,43.18 54.61,40.01 55.24,39.37 55.24,34.29 55.88,33.66 55.88,30.48 57.15,29.21 57.15,18.41 55.88,17.14 55.88,15.24 57.78,13.34 57.78,5.08 58.42,4.45 70.48,4.45 71.12,5.08
  Bottom 0.305: 63.5,50.8 IC10.1 | IC10.9 76.2,58.42 74.93,57.15 69.85,57.15 68.58,58.42 IC10.12 | 63.5,50.8 62.87,50.16 v55.88,50.16 | IC10.4 71.12,50.8 70.48,50.16 64.14,50.16 63.5,50.8
IR11  (via drill 0.6)  (1 unrouted)
  off 0.305: UROM1.6 109.22,59.69 110.49,58.42 110.49,45.09 109.22,43.81 UROM2.6 v109.22,32.38 109.22,28.57 110.49,27.3 110.49,10.16 109.22,8.89 UROM3.6 | IC9.9 83.82,22.86 85.09,24.13 85.09,31.75 v85.72,32.38
  Bottom 0.305: v85.72,32.38 89.53,32.38 90.17,31.75 104.78,31.75 105.41,32.38 v109.22,32.38
IR12  (via drill 0.6)  (1 unrouted)
  off 0.305: UROM1.5 106.68,59.69 107.95,58.42 107.95,53.34 106.68,52.07 UROM2.5 106.68,28.57 107.95,27.3 v107.95,15.24 107.95,10.16 106.68,8.89 UROM3.5 | IC9.12 83.82,24.13 82.55,22.86 82.55,20.32 83.82,19.05 v85.09,19.05
  Bottom 0.305: v85.09,19.05 86.36,17.78 88.27,17.78 90.81,15.24 100.97,15.24 102.23,16.51 106.68,16.51 v107.95,15.24
IR13  (via drill 0.6)  (1 unrouted)
  off 0.305: UROM1.27 109.22,87.63 107.95,86.36 107.95,59.69 109.22,58.42 UROM2.27 109.22,45.09 107.95,43.81 v107.95,31.11 107.95,28.57 109.22,27.3 UROM3.27
  Bottom 0.305: IC9.15 76.2,30.48 76.83,31.11 v107.95,31.11
IR14  (via drill 0.6)  (1 unrouted)
  off 0.305: UROM1.26 111.76,87.63 110.49,86.36 110.49,59.69 111.76,58.42 UROM2.26 111.76,45.09 110.49,43.81 110.49,28.57 v111.76,27.3 UROM3.26 | v72.39,24.77 72.39,26.67 73.66,27.94 IC9.16
  Bottom 0.305: v72.39,24.77 72.39,26.04 73.03,26.67 78.74,26.67 80.64,24.77 81.92,24.77 82.55,25.4 88.27,25.4 89.53,24.13 91.44,24.13 93.98,26.67 99.69,26.67 100.33,27.3 103.5,27.3 104.14,27.94 111.12,27.94 v111.76,27.3 111.12,27.3
IR15  (via drill 0.6)  (1 unrouted)
  off 0.305: UROM1.23 119.38,87.63 118.11,86.36 v118.11,67.94 118.11,59.69 119.38,58.42 UROM2.23 119.38,45.09 118.11,43.81 118.11,38.73 119.38,37.47 UROM3.23 | IC9.19 66.04,33.02 67.31,34.29 v67.31,56.52 | v87,56.52 87,59.05 v93.34,65.41
  Bottom 0.305: v67.31,56.52 67.94,55.88 86.36,55.88 v87,56.52 | v118.11,67.94 117.47,67.31 95.25,67.31 v93.34,65.41
N$1  (via drill 0.6)  (1 unrouted)
  off 0.305: UROM1.24 116.84,87.63 115.57,86.36 115.57,59.69 116.84,58.42 UROM2.24 116.84,45.09 115.57,43.81 115.57,38.73 116.84,37.47 UROM3.24 | 10.16,86.36 8.89,87.63 8.89,91.44 v10.16,92.71
  Bottom 0.305: UROM1.24 116.84,91.44 112.39,95.89 106.68,95.89 105.41,97.16 34.29,97.16 31.11,93.98 11.43,93.98 v10.16,92.71
N$2  (via drill 0.6)
  off 0.305: v28.57,56.52 27.94,55.88 27.94,43.18 v28.57,42.55 | v8.89,40.01 8.89,27.94 7.62,26.67 IC16.1
  Bottom 0.305: IC14.10 44.45,58.42 43.81,57.78 40.64,57.78 38.1,55.24 29.84,55.24 v28.57,56.52 | v28.57,42.55 26.67,40.64 11.43,40.64 10.79,40.01 v8.89,40.01
N$7
  off 0.305: IC4.13 R5.1
N$8
  off 0.305: IC4.12 R6.1
N$9
  off 0.305: IC4.11 R7.1
N$10
  off 0.305: IC4.10 R8.1
N$11
  off 0.305: IC4.9 R9.1
N$12  (via drill 0.6)
  off 0.305: IC4.7 49.53,65.41 50.8,64.14 50.8,57.78 v50.16,57.15
  Bottom 0.305: v50.16,57.15 50.8,57.78 55.24,57.78 R10.1
N$13  (via drill 0.6)
  off 0.305: v45.72,57.78 46.99,56.52 IC14.6
  Bottom 0.305: IC14.13 36.83,60.96 38.1,62.23 44.45,62.23 45.72,60.96 v45.72,57.78
N$14
  off 0.305: IC14.11 41.91,55.24 40.64,53.98 40.64,48.9 41.91,47.62 41.91,35.56 41.27,34.92 41.27,31.75 41.91,31.11 IC21.11
N$15  (1 unrouted)
N$16  (1 unrouted)
N$17  (1 unrouted)
N$18  (1 unrouted)
N$19  (1 unrouted)
N$20  (1 unrouted)
N$21  (1 unrouted)
N$22  (1 unrouted)
N$23  (1 unrouted)
N$24  (1 unrouted)
N$25  (1 unrouted)
N$26  (1 unrouted)
N$27  (1 unrouted)
N$28  (1 unrouted)
N$29  (1 unrouted)
N$30  (1 unrouted)
OP1_BRANCH
  off 0.305: IC18.3 12.7,35.56 13.97,34.29 13.97,29.21 12.7,27.94 IC16.3
OP2_ROLL  (via drill 0.6)
  off 0.305: IC18.4 15.24,40.01 16.51,41.27 16.51,61.59 v17.14,62.23
  Bottom 0.305: v17.14,62.23 17.78,62.87 45.72,62.87 46.99,61.59 IC14.9
OPIF0
  off 0.305: IC17.14 12.7,63.5 13.97,64.77 13.97,70.48 16.51,73.03 16.51,85.72 19.05,88.27 19.05,92.71 20.95,94.61 26.67,94.61 R1.1
  Bottom 0.305: UROM1.21 124.46,91.44 118.75,97.16 106.68,97.16 106.05,97.79 33.66,97.79 31.75,95.89 R1.1
OPIF1  (via drill 0.6)
  off 0.305: v10.16,47.62 IC17.2 | v101.6,35.56 v101.6,38.73 | v50.16,46.99 50.16,46.35 49.53,45.72 49.53,34.92 50.16,34.29 v52.07,34.29
  Bottom 0.305: v10.16,47.62 11.43,47.62 12.06,48.26 13.97,48.26 15.24,46.99 v50.16,46.99 | v52.07,34.29 53.34,33.02 68.58,33.02 70.48,34.92 87,34.92 88.27,36.2 93.98,36.2 94.61,35.56 95.89,35.56 R2.1 98.42,35.56 v101.6,35.56 | UROM2.13 127,40.01 126.36,39.37 102.23,39.37 v101.6,38.73
OPIF2  (via drill 0.6)
  off 0.305: v130.81,46.35 129.54,45.09 UROM2.14
  Bottom 0.305: IC18.14 12.7,45.72 13.34,46.35 29.84,46.35 R3.1 32.38,46.35 48.9,46.35 49.53,45.72 58.42,45.72 60.96,48.26 86.36,48.26 88.27,46.35 93.34,46.35 94.61,45.09 128.91,45.09 130.18,46.35 v130.81,46.35
OPIF3  (via drill 0.6)
  off 0.305: R4.1 28.57,33.66 28.57,39.37 v29.21,40.01
  Bottom 0.305: IC18.2 10.16,38.1 12.06,40.01 v29.21,40.01 33.02,40.01 36.2,36.83 50.16,36.83 52.07,38.73 60.96,38.73 61.59,39.37 68.58,39.37 69.22,40.01 70.48,40.01 71.12,39.37 91.44,39.37 95.25,43.18 131.44,43.18 132.08,42.55 UROM2.15
PAGE0
  off 0.305: IC10.3 68.58,48.9 69.85,47.62 69.85,41.27 71.12,40.01 IC13.4
PAGE1
  off 0.305: IC10.6 76.2,48.26 74.93,46.99 74.93,39.37 73.66,38.1 IC13.5
PAGE2
  off 0.305: IC10.8 78.74,55.88 77.47,54.61 77.47,39.37 76.2,38.1 IC13.6
PAGE3  (via drill 0.6)
  off 0.305: v80.64,60.33 80.64,48.26 80.01,47.62 80.01,39.37 78.74,38.1 IC13.7
  Bottom 0.305: IC10.11 71.12,60.33 72.39,61.59 79.38,61.59 v80.64,60.33
PAGE4
  off 0.305: IC11.6 76.2,9.53 77.47,10.79 77.47,22.86 80.01,25.4 80.01,33.66 81.28,34.92 IC13.8
PAGE5
  off 0.305: IC13.9 83.82,34.92 82.55,33.66 82.55,25.4 80.01,22.86 80.01,16.51 78.74,15.24 IC11.8
PC10  (via drill 0.6)
  off 0.305: CTRL.B12 151.13,59.69 146.69,59.69 144.78,57.78 v144.78,50.8
  Bottom 0.305: IC10.2 66.04,52.7 67.94,54.61 93.34,54.61 94.61,53.34 120.65,53.34 123.19,50.8 141.6,50.8 142.24,51.44 144.15,51.44 v144.78,50.8
PC11  (via drill 0.6)
  off 0.305: CTRL.B13 151.13,57.15 146.69,57.15 146.05,56.52 146.05,50.16 145.41,49.53 143.51,49.53 v142.88,50.16
  Bottom 0.305: IC10.5 73.66,53.34 74.3,53.98 92.71,53.98 93.98,52.7 120.02,52.7 122.56,50.16 v142.88,50.16
PC12  (via drill 0.6)
  off 0.305: CTRL.B14 151.13,54.61 147.96,54.61 v147.32,53.98 | IC10.10 73.66,57.78 74.3,57.15 v77.47,57.15
  Bottom 0.305: v77.47,57.15 78.11,57.78 87.63,57.78 89.53,55.88 94.61,55.88 95.89,54.61 121.92,54.61 123.83,52.7 126.36,52.7 127.64,53.98 129.54,53.98 130.81,52.7 139.7,52.7 140.34,53.34 146.69,53.34 v147.32,53.98
PC13
  Bottom 0.305: CTRL.B15 151.13,52.07 141.6,52.07 140.97,51.44 123.83,51.44 121.28,53.98 95.25,53.98 93.98,55.24 66.67,55.24 66.04,55.88 IC10.13
PC14  (via drill 0.6)
  off 0.305: IC11.5 73.66,10.79 v72.39,12.06 | v54.61,11.43 55.24,12.06 55.24,17.78 56.52,19.05 56.52,22.23 54.61,24.13 54.61,32.38 53.98,33.02 53.98,38.1 53.34,38.73 53.34,45.72 v54.61,46.99 | CTRL.B16 151.13,49.53 148.59,49.53 v147.32,48.26
  Bottom 0.305: v72.39,12.06 67.31,12.06 65.41,10.16 56.52,10.16 55.24,11.43 v54.61,11.43 | v54.61,46.99 57.15,49.53 90.17,49.53 91.44,48.26 117.47,48.26 118.11,47.62 127.64,47.62 128.91,48.9 137.16,48.9 139.06,46.99 140.34,46.99 140.97,47.62 146.69,47.62 v147.32,48.26
PC15  (via drill 0.6)
  off 0.305: v89.53,48.26 88.9,47.62 88.9,40.01 89.53,39.37 89.53,37.47 90.81,36.2 90.81,29.84 91.44,29.21 91.44,24.77 90.81,24.13 90.81,20.32 88.9,18.41 88.9,17.78 87.63,16.51 87.63,13.34 87,12.7 80.01,12.7 v78.74,11.43
  Bottom 0.305: v89.53,48.26 90.17,47.62 94.61,47.62 95.89,46.35 112.39,46.35 113.67,47.62 116.84,47.62 117.47,46.99 128.27,46.99 129.54,48.26 136.53,48.26 138.43,46.35 140.97,46.35 141.6,46.99 151.13,46.99 CTRL.B17 | v78.74,11.43 74.3,11.43 73.66,12.06 IC11.10
RESERVED_POWER
  Bottom 1.016: CTRL.C4 CTRL.B4 CTRL.A4
RSTHOLD
  off 0.305: IC18.1 7.62,40.64 8.89,41.91 8.89,48.26 7.62,49.53 IC17.1 7.62,55.24 8.89,56.52 8.89,70.48 11.43,73.03 11.43,92.71 12.7,93.98 16.51,93.98 17.78,92.71 IC1.10
RUNIT0  (via drill 0.6)
  off 0.305: v128.27,58.42 128.27,62.87 127,64.14 UROM1.13
  Bottom 0.305: v128.27,58.42 129.54,59.69 131.44,59.69 132.08,59.05 142.24,59.05 144.15,57.15 153.67,57.15 CTRL.A14
RUNIT1  (via drill 0.6)
  off 0.305: v140.97,57.15 140.97,59.69 139.06,61.59 139.06,83.19 v139.7,83.82 | v129.54,85.09 UROM1.14
  Bottom 0.305: v139.7,83.82 137.79,85.72 130.18,85.72 v129.54,85.09 | CTRL.A15 153.67,54.61 148.59,54.61 147.96,55.24 142.88,55.24 v140.97,57.15
RUNIT2  (via drill 0.6)
  off 0.305: v139.7,48.26 138.43,49.53 138.43,53.34 139.7,54.61 139.7,59.69 137.79,61.59 v137.79,81.92 | v131.44,83.19 131.44,76.83 132.08,76.2 UROM1.15
  Bottom 0.305: v137.79,81.92 135.89,81.92 134.62,83.19 v131.44,83.19 | CTRL.A16 153.67,49.53 146.69,49.53 145.41,48.26 v139.7,48.26
RUNIT3  (via drill 0.6)
  off 0.305: CTRL.A18 153.67,46.99 144.78,46.99 v142.88,45.09 | UROM1.17 134.62,88.9 132.72,87 132.72,76.83 133.35,76.2 133.35,62.23 135.89,59.69 v135.89,45.72
  Bottom 0.305: v135.89,45.72 136.53,45.09 v142.88,45.09
SKIP0  (via drill 0.6)
  off 0.305: v21.59,65.41 21.59,41.27 22.86,40.01 IC18.7
  Bottom 0.305: IC7.4 15.24,68.58 15.88,69.22 20.95,69.22 21.59,68.58 v21.59,65.41
SL  (via drill 0.6)
  off 0.305: IC21.8 49.53,31.75 48.9,32.38 v48.9,49.53
  Bottom 0.305: IC14.5 44.45,50.8 45.72,49.53 v48.9,49.53
SN
  off 0.305: IC14.3 39.37,48.9 40.64,47.62 40.64,26.04 39.37,24.77 IC21.3
SZ  (via drill 0.6)
  off 0.305: IC14.4 41.91,48.9 43.18,47.62 43.18,35.56 v43.81,34.92 | v50.8,33.02 51.44,32.38 51.44,20.95 50.16,19.68 47.62,19.68 46.99,20.32 IC21.6
  Bottom 0.305: v43.81,34.92 44.45,34.92 46.35,33.02 v50.8,33.02
UINSTR18  (via drill 0.6)
  off 0.305: v147.96,10.16 147.96,9.53 149.22,8.26 156.21,8.26 157.48,9.53 157.48,66.04 CTRL.A9
  Bottom 0.305: UROM3.15 132.08,7.62 133.35,8.89 146.69,8.89 v147.96,10.16
UPC0  (via drill 0.6)  (1 unrouted)
  off 0.305: UROM1.12 124.46,64.14 125.73,62.87 125.73,45.09 124.46,43.81 UROM2.12 124.46,38.73 125.73,37.47 125.73,8.89 124.46,7.62 UROM3.12 | IC2.14 39.37,12.06 38.1,10.79 v38.1,3.17
  Bottom 0.305: UROM3.12 124.46,5.08 121.28,1.91 45.09,1.91 44.45,1.27 40.01,1.27 v38.1,3.17 34.29,3.17 29.84,7.62 15.24,7.62 UPC.1
UPC1  (via drill 0.6)  (1 unrouted)
  off 0.305: UROM1.11 121.92,63.5 123.19,62.23 123.19,45.09 121.92,43.81 UROM2.11 121.92,38.73 123.19,37.47 123.19,10.16 121.92,8.89 UROM3.11 | v40.64,3.17 v40.64,8.89 40.64,10.79 41.91,12.06 IC2.13
  Bottom 0.305: UROM3.11 121.92,5.08 119.38,2.54 44.45,2.54 43.81,1.91 41.91,1.91 v40.64,3.17 | UPC.3 16.51,8.89 v40.64,8.89
UPC2  (via drill 0.6)  (1 unrouted)
  off 0.305: UROM1.10 119.38,59.69 120.65,58.42 120.65,45.09 119.38,43.81 UROM2.10 119.38,38.73 120.65,37.47 120.65,9.53 119.38,8.26 UROM3.10 | v43.18,3.17 v43.18,9.53 44.45,10.79 IC2.12
  Bottom 0.305: UROM3.10 119.38,5.08 117.47,3.17 v43.18,3.17 | UPC.5 17.78,10.16 42.55,10.16 v43.18,9.53
UPC3  (via drill 0.6)  (1 unrouted)
  off 0.305: UROM3.9 116.84,8.89 118.11,10.16 118.11,37.47 116.84,38.73 UROM2.9 116.84,43.81 118.11,45.09 118.11,58.42 116.84,59.69 UROM1.9 | IC2.11 v46.99,8.89
  Bottom 0.305: v46.99,8.89 47.62,8.26 53.34,8.26 53.98,7.62 61.59,7.62 62.23,8.26 116.2,8.26 116.84,7.62 UROM3.9 | IC2.11 46.99,15.24 45.72,16.51 27.3,16.51 26.04,15.24 26.04,12.7 24.77,11.43 19.05,11.43 UPC.7
VCC  (via drill 0.6)  (8 unrouted)
  Bottom 0.61: UROM3.31 99.06,22.23 100.97,24.13 115.57,24.13 118.11,26.67 133.35,26.67 135.89,24.13 140.97,24.13 v141.6,24.77
  Bottom 1.27: v5.71,78.74 v21.59,78.74 | v53.98,22.86 v60.96,22.86 | v34.29,40.64 36.83,38.1 48.9,38.1 51.44,40.64 v57.15,40.64 | v21.59,19.68 v27.94,19.68 | v7.62,64.14 v10.16,64.14 | v20.32,48.9 v30.48,48.9 | C22.1 CTRL.C32 | v55.88,87.63 46.35,87.63 v44.45,89.53 34.29,89.53 v33.66,88.9 | v55.88,78.11 55.88,80.01 v57.15,81.28
  pour off (isolate 0.635, no thermals): 0,0 160.02,0 160.02,99.06 0,99.06
WUNIT0  (via drill 0.6)
  off 0.305: UROM1.18 RN1.2 | IC4.1 34.29,71.12 35.56,72.39 v35.56,92.08
  Bottom 0.305: UROM1.18 132.08,88.9 130.18,87 111.12,87 110.49,87.63 110.49,91.44 109.86,92.08 102.87,92.08 100.97,93.98 52.07,93.98 50.16,92.08 v35.56,92.08
WUNIT1  (via drill 0.6)
  off 0.305: UROM1.19 RN1.3 | v38.1,93.34 38.1,72.39 36.83,71.12 IC4.2
  Bottom 0.305: UROM1.19 129.54,88.9 128.27,87.63 113.67,87.63 113.03,88.27 113.03,91.44 111.76,92.71 103.5,92.71 101.6,94.61 51.44,94.61 50.16,93.34 v38.1,93.34
WUNIT2  (via drill 0.6)
  off 0.305: UROM1.20 RN1.4 | v40.64,94.61 40.64,71.12 39.37,69.85 IC4.3
  Bottom 0.305: UROM1.20 127,88.9 126.36,88.27 116.2,88.27 115.57,88.9 115.57,91.44 113.67,93.34 104.14,93.34 102.23,95.25 50.8,95.25 50.16,94.61 v40.64,94.61
YA  (via drill 0.6)
  off 0.305: v24.13,38.73 24.13,48.26 22.86,49.53 IC17.7
  Bottom 0.305: IC18.6 20.32,35.56 20.95,34.92 23.5,34.92 24.13,35.56 v24.13,38.73
YB  (via drill 0.6)
  off 0.305: v19.05,61.59 19.05,41.27 17.78,40.01 IC18.5
  Bottom 0.305: IC17.9 25.4,60.96 24.13,62.23 19.68,62.23 v19.05,61.59

## Text on the board
off: (c) 2011 AlexiosC
Bottom: (c) 2011 AlexiosC
tNames: http://www.bedroomlan.org/cft | IR LSB | IR0 | 1 | 2 | 3 | 4 | 5 | 6 | 7 | Microcode ROMs | Write Unit Decoder | AGL LSB | Skip/Branch Unit | (c) 2011 AlexiosC | Microcode v.3 only! | AGL MSB | F | E | D | C | IRn | 8 | 9 | A | B | CFT CONTROL BUS | IR MSB | uPC3 | uPC Counter | uPC2 | uPC1 | uPC0 | 1 | 2 | 3 | uPC0 | CFT Control Unit Rev F